# EAGLE design DPbadge-contoured (EAGLE 5.07)
LICENSE: CC-0
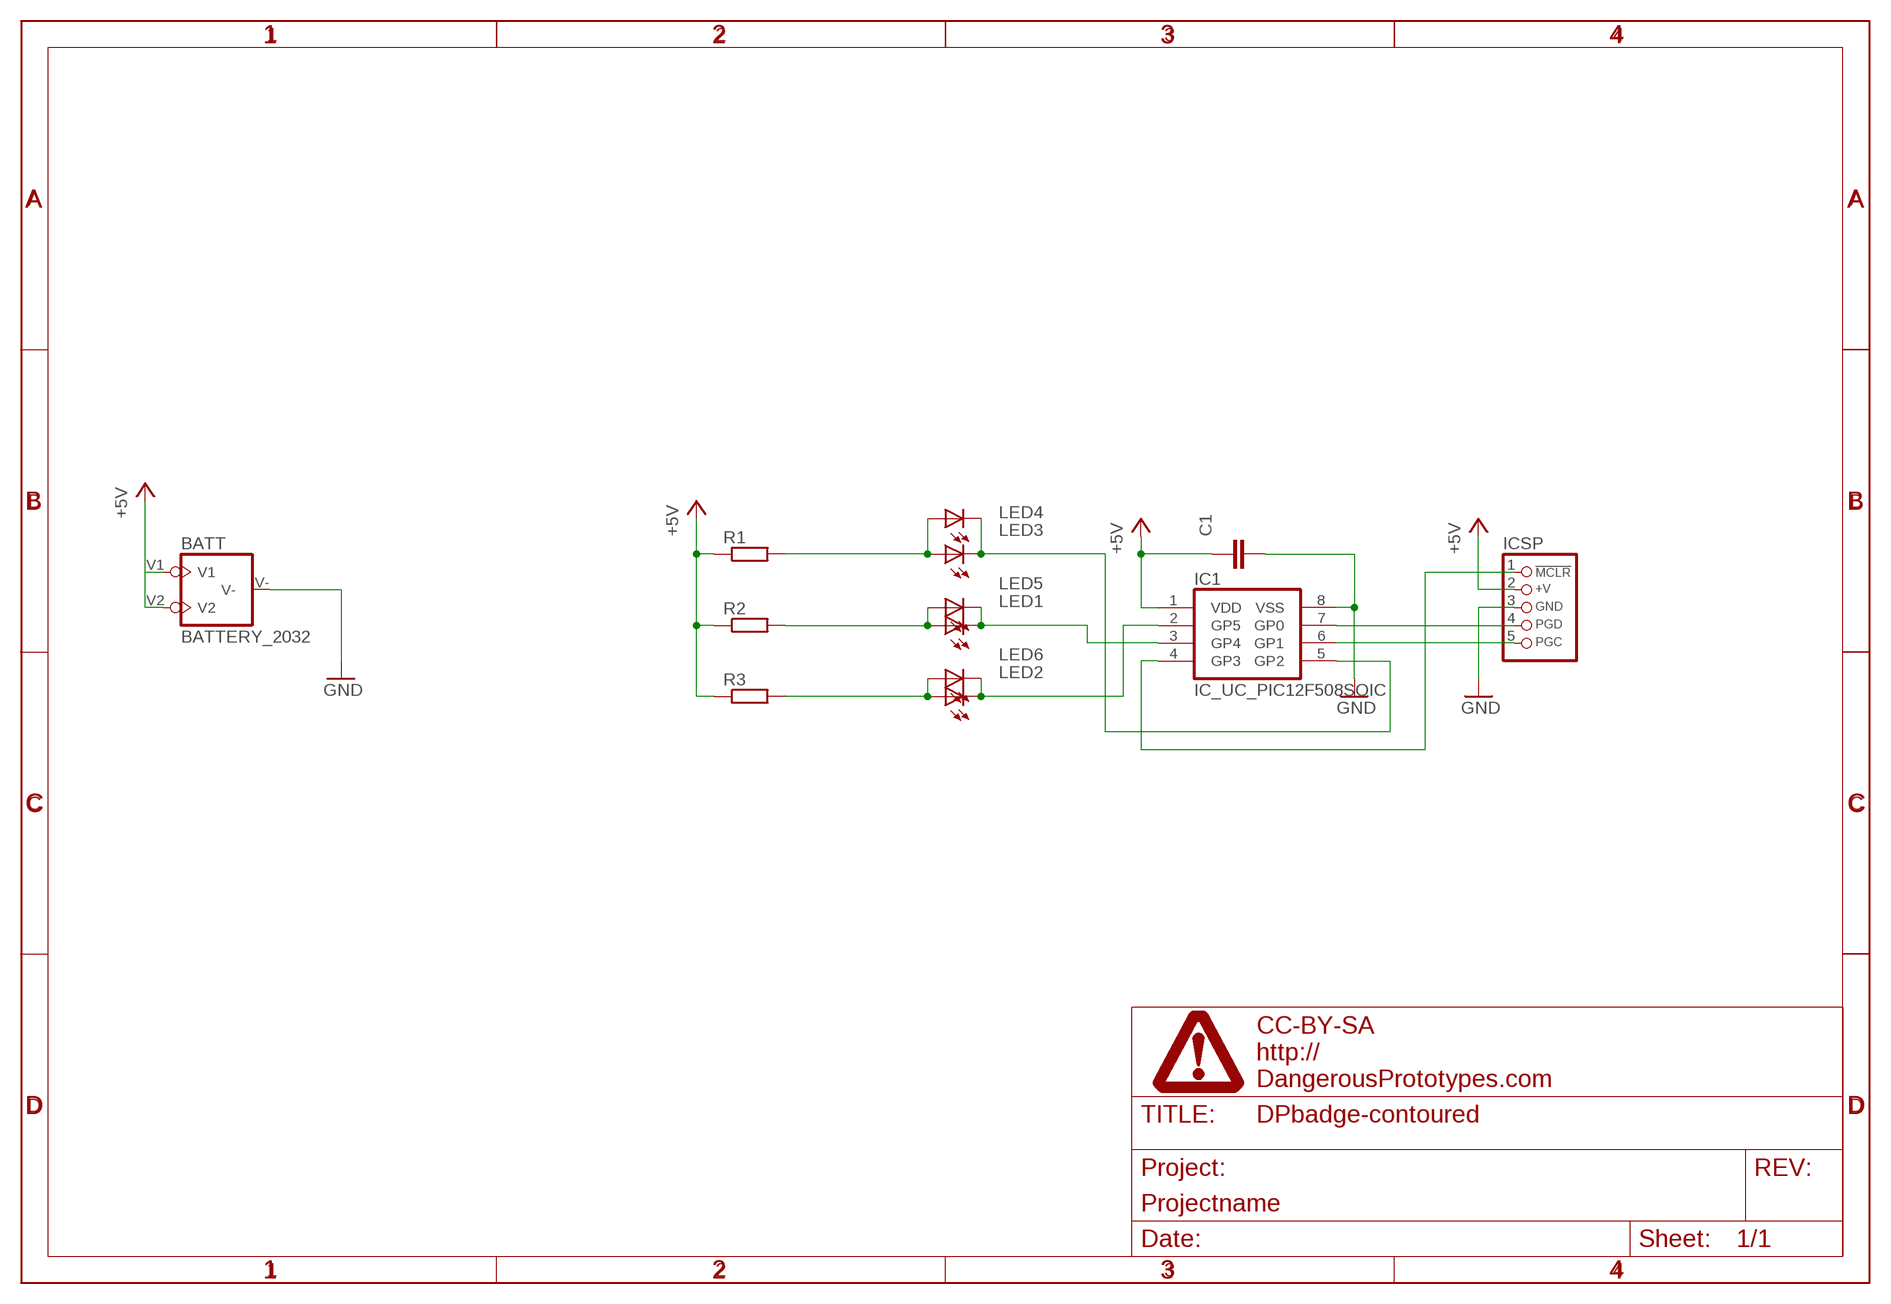
[diagram p0: schematic, sheet 1]

## Parts
BATT  BATTERY_2032  [BATT2032]
C1  CAPACITOR_NPOL-0603  [C603]
IC1  IC_UC_PIC12F508SOIC  [SO-8]
ICSP  CON_HEADER_PRG_PIC_ICSPB  [HEADER_PRG_1X05_ICSP_B]
LED1  LED-3MM  [LED-3MM]
LED2  LED-3MM  [LED-3MM]
LED3  LED-3MM  [LED-3MM]
LED4  LED-0805  [LED-805]
LED5  LED-0805  [LED-805]
LED6  LED-0805  [LED-805]
R1  RESISTOR-0603  [R603]
R2  RESISTOR-0603  [R603]
R3  RESISTOR-0603  [R603]
U$1  FRAME_DINA4_L  [DP_LOGO]

## Nets
+5V: BATT.V1 BATT.V2 C1.1 IC1.1(VDD) ICSP.2(+V) R1.1 R2.1 R3.1
GND: BATT.V- C1.2 IC1.8(VSS) ICSP.3(GND)
N$1: IC1.5(GP2) LED3.K(C) LED4.C
N$2: LED3.A LED4.A R1.2
N$3: IC1.2(GP5) LED2.K(C) LED6.C
N$4: LED2.A LED6.A R3.2
N$5: IC1.6(GP1) ICSP.5(PGC)
N$7: IC1.3(GP4) LED1.K(C) LED5.C
N$8: IC1.7(GP0) ICSP.4(PGD)
N$9: IC1.4(GP3) ICSP.1(/MCLR)
N$10: LED1.A LED5.A R2.2

## Library data of the parts
BATT = dp_devices:BATTERY_2032: BATTERY
C1 = dp_devices:CAPACITOR_NPOL: Non-Polarized capacitor in various packages
IC1 = dp_devices:IC_UC_PIC12F508
ICSP = dp_devices:CON_HEADER_PRG_PIC_ICSP: 5-pin PIC In Circuit Serial Programming header
LED1-LED6 = dp_devices:LED: Light Emitting Diode
R1-R3 = dp_devices:RESISTOR
U$1 = dp_devices:FRAME_DINA4_L: A4 DP frame Standard Dangerous Prototypes schematic frame. Automagically adds the DP logo and standard texts to the PCB Use the atrribute in the schematic editor to change the fields.; FF1: fulfillment by; FF2: Seeed Studio; FF3: www.seeedstudio.com; LICENSE: CC-BY-SA; PROJECT: Projectname; URL1: http://; URL2: DangerousPrototypes.com

## Board
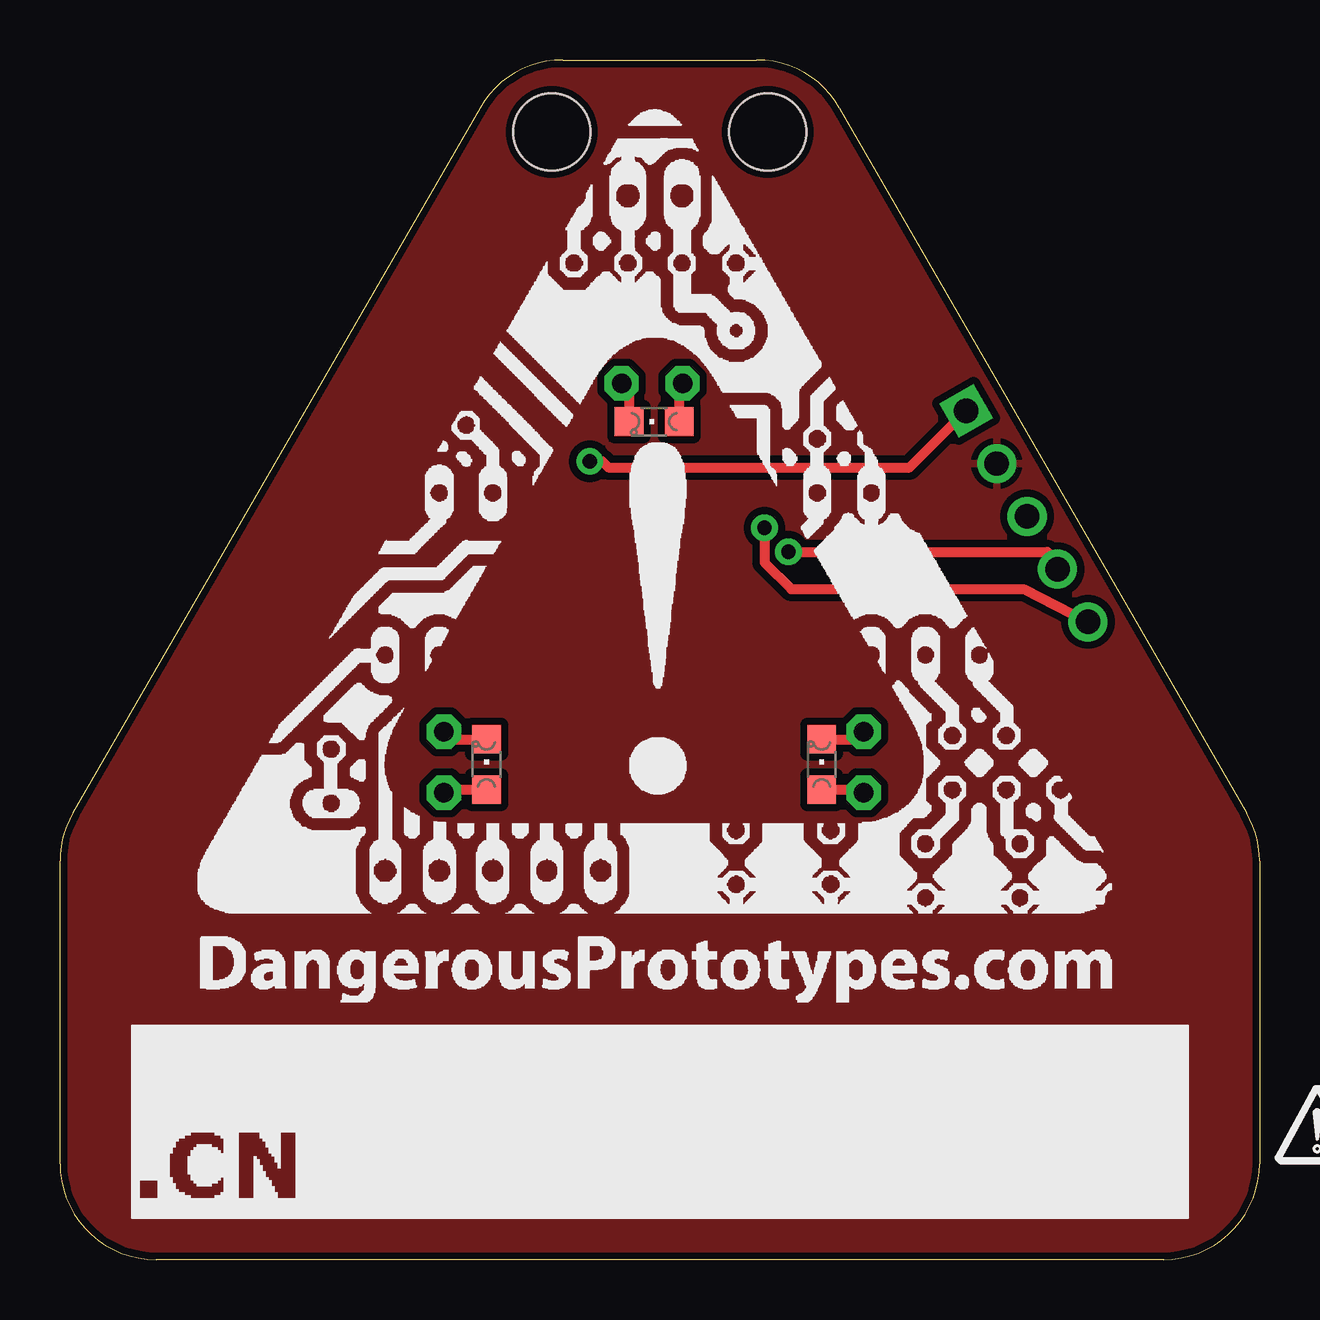
[diagram p1: board, top side]
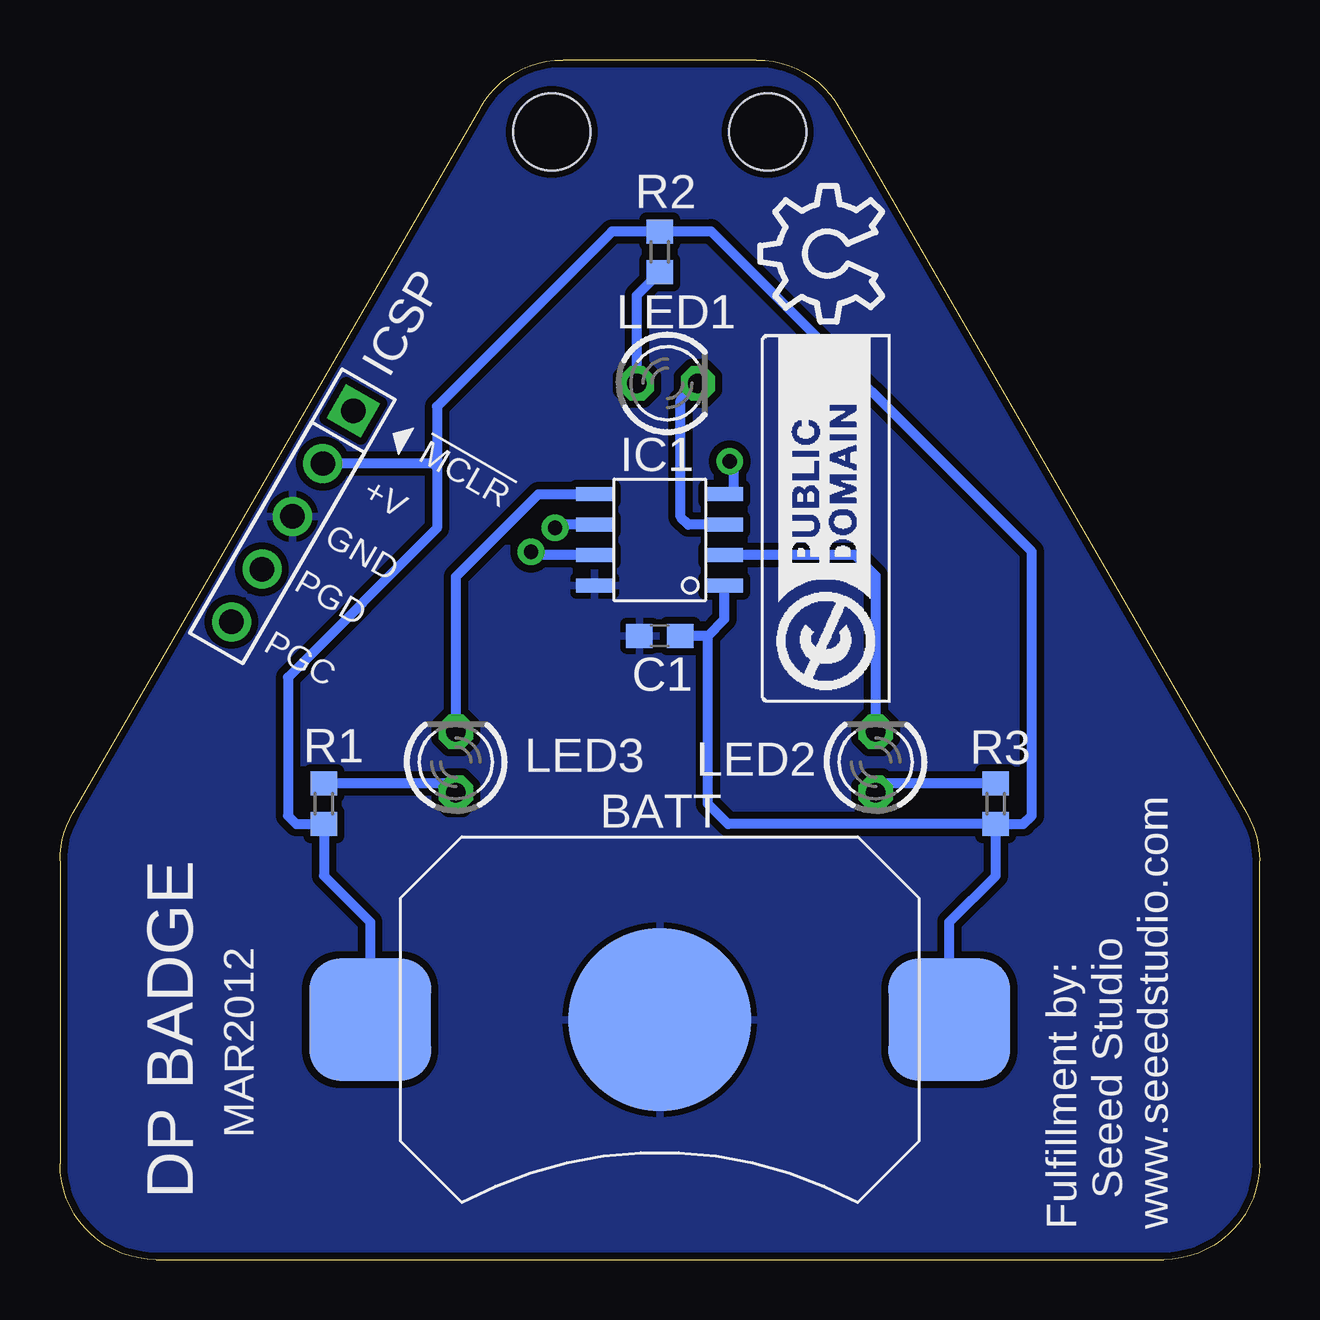
[diagram p2: board, bottom side, seen from below]

Size 50 x 50 mm. Coordinates in mm from the lower left corner, seen from the top.
Outline: 20.96,50 29.04,50 arc-60 32.5,48 49.46,18.62 arc-30 50,16.62 50,4 arc-90 46,0 4,0 arc-90 0,4 0,16.62 arc-30 0.54,18.62 17.5,48 arc-60 20.96,50
Copper layers (1*16): Top 0.035mm / dielectric 1.5mm / Bottom 0.035mm
Design rules "SparkFun": minimum track width 8mil, minimum drill 20mil, track to track 8mil, track to pad 8mil, pad to pad 8mil, via to via 8mil, smd to smd 8mil, copper to edge 10mil, drill to drill 8mil, minimum pad ring 12mil, minimum via ring 10mil, stop-mask expansion 4mil, vias tented up to drill 25mil, thermal gap 10mil
Holes 3.2 mm at 20.5,47 29.5,47

### Footprints (pad centres in the part's own frame; a part is rotated, then mirrored left to right if it is on the bottom)
BATT2032 = smd 5.08 x 5.08: V1 -12.065,0; V2 12.065,0 | smd 7.62 x 7.62: V- 0,0
C603 = smd 1.1 x 1: 1 -0.85,0; 2 0.85,0
SO-8 = smd 0.6 x 1.55: 1 -1.905,-2.69; 2 -0.635,-2.69; 3 0.635,-2.69; 4 1.905,-2.69; 5 1.905,2.71; 6 0.635,2.71; 7 -0.635,2.71; 8 -1.905,2.71
HEADER_PRG_1X05_ICSP_B = drill 1.016 square: 1 -5.08,0 | drill 1.016 round: 2 -2.54,0; 3 0,0; 4 2.54,0; 5 5.08,0
LED-3MM = drill 0.813 octagon: A -1.27,0; K 1.27,0
LED-805 = smd 1.2 x 1.2: A 0,-1.05; C 0,1.05
R603 = smd 1 x 1.1: 1 -0.85,0; 2 0.85,0

### Placement (x,y rotation side)
BATT  25,10 0 bottom
C1  25,26 180 bottom
IC1  25,30 90 bottom
ICSP  40.31,30.98 240 bottom
LED1  24.68,36.52 0 bottom
LED2  16,20.73 90 bottom
LED3  33.5,20.73 90 bottom
LED4  31.75,20.64 0 top
LED5  24.77,34.92 90 top
LED6  17.78,20.64 0 top
R1  39,19 90 bottom
R2  25,42 270 bottom
R3  11,19 90 bottom
U$1  52.4,4.62 0 top
U$2  [DP_LOGO_ART_1.5X1.5]  5.75,10.73 0 top
U$3  [LOGO_CC-0]  15.4,23.23 90 bottom
U$4  [.CN]  3.12,1.88 0 top
U$5  [OSHW_10X200_NOTEXT]  15.73,39.09 90 bottom

### Tracks (layer width: path | path; a pad name or v marks a point on that pad's centre or on a via)
+5V
  Bottom 0.406: 23,26 C1.1 | IC1.1 22.31,26.69 23,26 | R3.1 11,16 12.94,14.06 BATT.V2 | BATT.V1 37.06,14.06 39,16 R1.1 40.15,18.15 40.5,18.5 40.5,24.27 34.29,30.48 34.29,33.02 | R3.1 9.85,18.15 9.5,18.5 9.5,29.5 22.86,42.86 22.87,42.85 R2.1 27,42.85 34.29,35.56 34.29,33.02 | R3.1 22.15,18.15 23,19 23,26 | ICSP.2 34.45,33.18 34.29,33.02
  pour Top (isolate 0.305): 18,50 0,18 0,0 50,0 50,18 32,50
GND
  pour Bottom (isolate 0.305): 18,50 0,18 0,0 50,0 50,18 32,50
N$1
  Top 0.406: LED4.C 33.19,21.69 LED3.K
  Bottom 0.406: LED3.K 33.5,28.46 30.05,31.91 IC1.5
N$2
  Top 0.406: LED4.A 33.37,19.59 LED3.A
  Bottom 0.406: R1.2 33.89,19.85 LED3.A
N$3
  Top 0.406: LED6.C 16.31,21.69 LED2.K
  Bottom 0.406: LED2.K 16,28.5 16.86,29.36 IC1.2
N$4
  Top 0.406: LED6.A 16.13,19.59 LED2.A
  Bottom 0.406: R3.2 15.61,19.85 LED2.A
N$5  (via drill 0.6)
  Top 0.406: v29.36,30.5 29.36,29.05 30.48,27.94 40.17,27.94 ICSP.5
  Bottom 0.406: IC1.6 29.23,30.64 v29.36,30.5
N$7
  Top 0.406: LED5.C 23.71,36.22 LED1.K
  Bottom 0.406: IC1.3 23.81,30.64 24.13,30.96 24.13,35.81 LED1.K
N$8  (via drill 0.6)
  Top 0.406: v30.36,29.5 41.16,29.5 ICSP.4
  Bottom 0.406: IC1.7 30.23,29.36 v30.36,29.5
N$9  (via drill 0.6)
  Top 0.406: v22.09,33.27 22.61,33.27 22.86,33.02 35.42,33.02 ICSP.1
  Bottom 0.406: IC1.4 22.07,31.91 21.91,32.07 21.91,33.09 v22.09,33.27
N$10
  Top 0.406: LED5.A 25.82,36.39 LED1.A
  Bottom 0.406: LED1.A 25.95,40.2 R2.2

### Text on the board
bNames: !MCLR | +V | GND | PGD | PGC | MAR2012 | Seeed Studio | DP BADGE | www.seeedstudio.com | Fulfillment by: